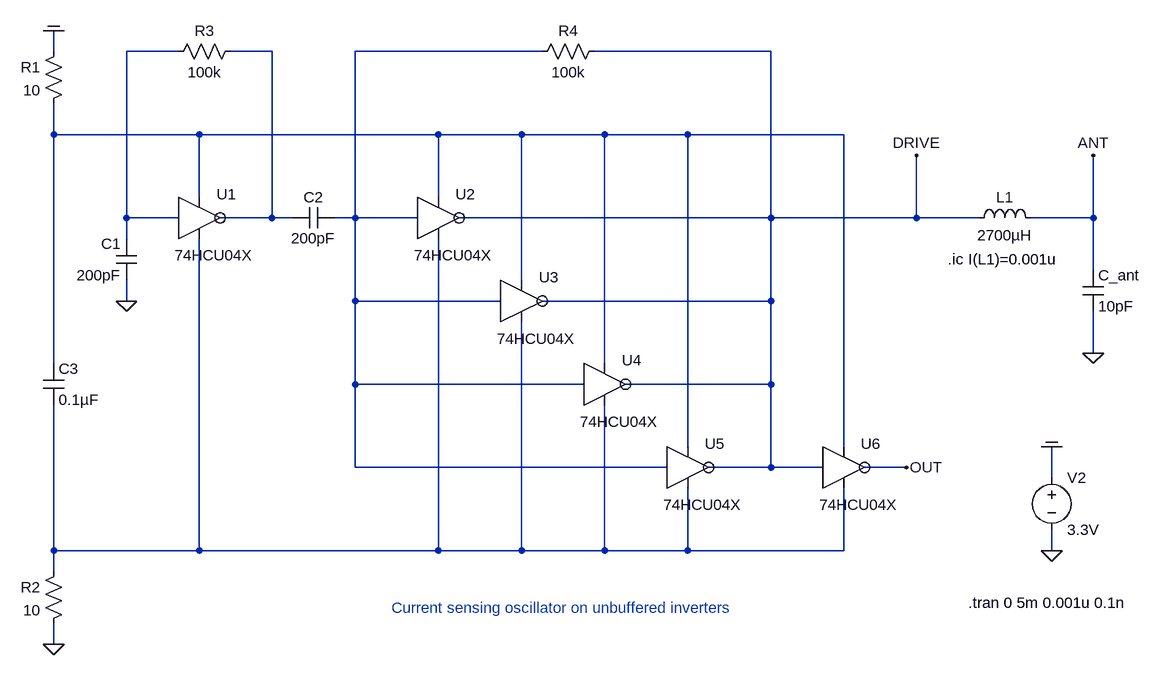
[diagram p0: schematic 2021_current_sensing_unbuffered_inverters_03.asc]
2021_current_sensing_unbuffered_inverters_03.asc, the LTspice schematic file:
Version 4
SHEET 1 13280 8692
WIRE 2448 5392 2448 5360
WIRE 2640 5392 2560 5392
WIRE 2784 5392 2720 5392
WIRE 3200 5392 2912 5392
WIRE 3552 5392 3280 5392
WIRE 2448 5520 2448 5472
WIRE 2672 5520 2448 5520
WIRE 3040 5520 2672 5520
WIRE 3168 5520 3040 5520
WIRE 3296 5520 3168 5520
WIRE 3424 5520 3296 5520
WIRE 3664 5520 3424 5520
WIRE 2672 5616 2672 5520
WIRE 3040 5616 3040 5520
WIRE 2560 5648 2560 5392
WIRE 2640 5648 2560 5648
WIRE 2784 5648 2784 5392
WIRE 2784 5648 2704 5648
WIRE 2816 5648 2784 5648
WIRE 2912 5648 2912 5392
WIRE 2912 5648 2880 5648
WIRE 3008 5648 2912 5648
WIRE 3552 5648 3552 5392
WIRE 3552 5648 3072 5648
WIRE 3776 5648 3776 5552
WIRE 3776 5648 3552 5648
WIRE 3872 5648 3776 5648
WIRE 4048 5648 4048 5552
WIRE 4048 5648 3952 5648
WIRE 2560 5680 2560 5648
WIRE 4048 5728 4048 5648
WIRE 3168 5744 3168 5520
WIRE 2560 5776 2560 5744
WIRE 2912 5776 2912 5648
WIRE 3136 5776 2912 5776
WIRE 3552 5776 3552 5648
WIRE 3552 5776 3200 5776
WIRE 4048 5856 4048 5792
WIRE 2448 5872 2448 5520
WIRE 3296 5872 3296 5520
WIRE 2912 5904 2912 5776
WIRE 3264 5904 2912 5904
WIRE 3552 5904 3552 5776
WIRE 3552 5904 3328 5904
WIRE 3424 6000 3424 5520
WIRE 3664 6000 3664 5520
WIRE 2912 6032 2912 5904
WIRE 3392 6032 2912 6032
WIRE 3552 6032 3552 5904
WIRE 3552 6032 3456 6032
WIRE 3632 6032 3552 6032
WIRE 3760 6032 3696 6032
WIRE 3984 6048 3984 6000
WIRE 2448 6160 2448 5936
WIRE 2672 6160 2672 5680
WIRE 2672 6160 2448 6160
WIRE 3040 6160 3040 5680
WIRE 3040 6160 2672 6160
WIRE 3168 6160 3168 5808
WIRE 3168 6160 3040 6160
WIRE 3296 6160 3296 5936
WIRE 3296 6160 3168 6160
WIRE 3424 6160 3424 6064
WIRE 3424 6160 3296 6160
WIRE 3664 6160 3664 6064
WIRE 3664 6160 3424 6160
WIRE 3984 6160 3984 6128
WIRE 2448 6192 2448 6160
WIRE 2448 6304 2448 6272
FLAG 3984 6160 0
FLAG 3984 6000 COM
FLAG 2448 6304 0
FLAG 2448 5360 COM
FLAG 4048 5856 0
FLAG 4048 5552 ANT
FLAG 3776 5552 DRIVE
FLAG 2560 5776 0
FLAG 3760 6032 OUT
SYMBOL voltage 3984 6032 R0
WINDOW 123 0 0 Left 2
WINDOW 39 0 0 Left 2
SYMATTR InstName V2
SYMATTR Value 3.3V
SYMBOL res 2464 6176 M0
WINDOW 0 36 40 Left 2
WINDOW 3 36 76 Left 2
SYMATTR InstName R2
SYMATTR Value 10
SYMBOL 74HCU04X 3040 5648 R0
SYMATTR InstName U2
SYMBOL res 2464 5376 M0
WINDOW 0 36 40 Left 2
WINDOW 3 36 76 Left 2
SYMATTR InstName R1
SYMATTR Value 10
SYMBOL cap 2432 5872 R0
SYMATTR InstName C3
SYMATTR Value 0.1µF
SYMBOL res 3296 5376 R90
WINDOW 0 0 56 VBottom 2
WINDOW 3 32 56 VTop 2
SYMATTR InstName R4
SYMATTR Value 100k
SYMBOL ind 3856 5664 R270
WINDOW 0 32 56 VTop 2
WINDOW 3 5 56 VBottom 2
SYMATTR InstName L1
SYMATTR Value 2700µH
SYMATTR SpiceLine Rser=120 Cpar=1.2pF
SYMBOL cap 4032 5728 R0
SYMATTR InstName C_ant
SYMATTR Value 10pF
SYMBOL cap 2880 5632 R90
WINDOW 0 0 32 VBottom 2
WINDOW 3 32 32 VTop 2
SYMATTR InstName C2
SYMATTR Value 200pF
SYMBOL 74HCU04X 3168 5776 R0
SYMATTR InstName U3
SYMBOL 74HCU04X 3296 5904 R0
SYMATTR InstName U4
SYMBOL 74HCU04X 2672 5648 R0
SYMATTR InstName U1
SYMBOL res 2736 5376 R90
WINDOW 0 0 56 VBottom 2
WINDOW 3 32 56 VTop 2
SYMATTR InstName R3
SYMATTR Value 100k
SYMBOL cap 2576 5744 R180
WINDOW 0 24 56 Left 2
WINDOW 3 24 8 Left 2
SYMATTR InstName C1
SYMATTR Value 200pF
SYMBOL 74HCU04X 3424 6032 R0
SYMATTR InstName U5
SYMBOL 74HCU04X 3664 6032 R0
SYMATTR InstName U6
TEXT 3856 6240 Left 2 !.tran 0 5m 0.001u 0.1n
TEXT 2968 6248 Left 2 ;Current sensing oscillator on unbuffered inverters
TEXT 3824 5712 Left 2 !.ic I(L1)=0.001u

The netlist it stands for:
* 2021_current_sensing_unbuffered_inverters_03.asc
V2 COM 0 3.3V
R2 N005 0 10
XU2 N003 DRIVE N004 N005 74HCU04X  ; pins A Y VCC AGND
R1 COM N004 10
C3 N004 N005 0.1µF
R4 DRIVE N003 100k
L1 DRIVE ANT 2700µH Rser=120 Cpar=1.2pF
C_ant ANT 0 10pF
C2 N003 N002 200pF
XU3 N003 DRIVE N004 N005 74HCU04X  ; pins A Y VCC AGND
XU4 N003 DRIVE N004 N005 74HCU04X  ; pins A Y VCC AGND
XU1 N001 N002 N004 N005 74HCU04X  ; pins A Y VCC AGND
R3 N002 N001 100k
C1 0 N001 200pF
XU5 N003 DRIVE N004 N005 74HCU04X  ; pins A Y VCC AGND
XU6 DRIVE OUT N004 N005 74HCU04X  ; pins A Y VCC AGND
.tran 0 5m 0.001u 0.1n
* Current sensing oscillator on unbuffered inverters
.ic I(L1)=0.001u
.lib 74HCU04X.cir
.backanno
.end